# Altium schematic sheet Sheet1.SchDoc
size A4; SheetNumber: 1; SheetTotal: 2
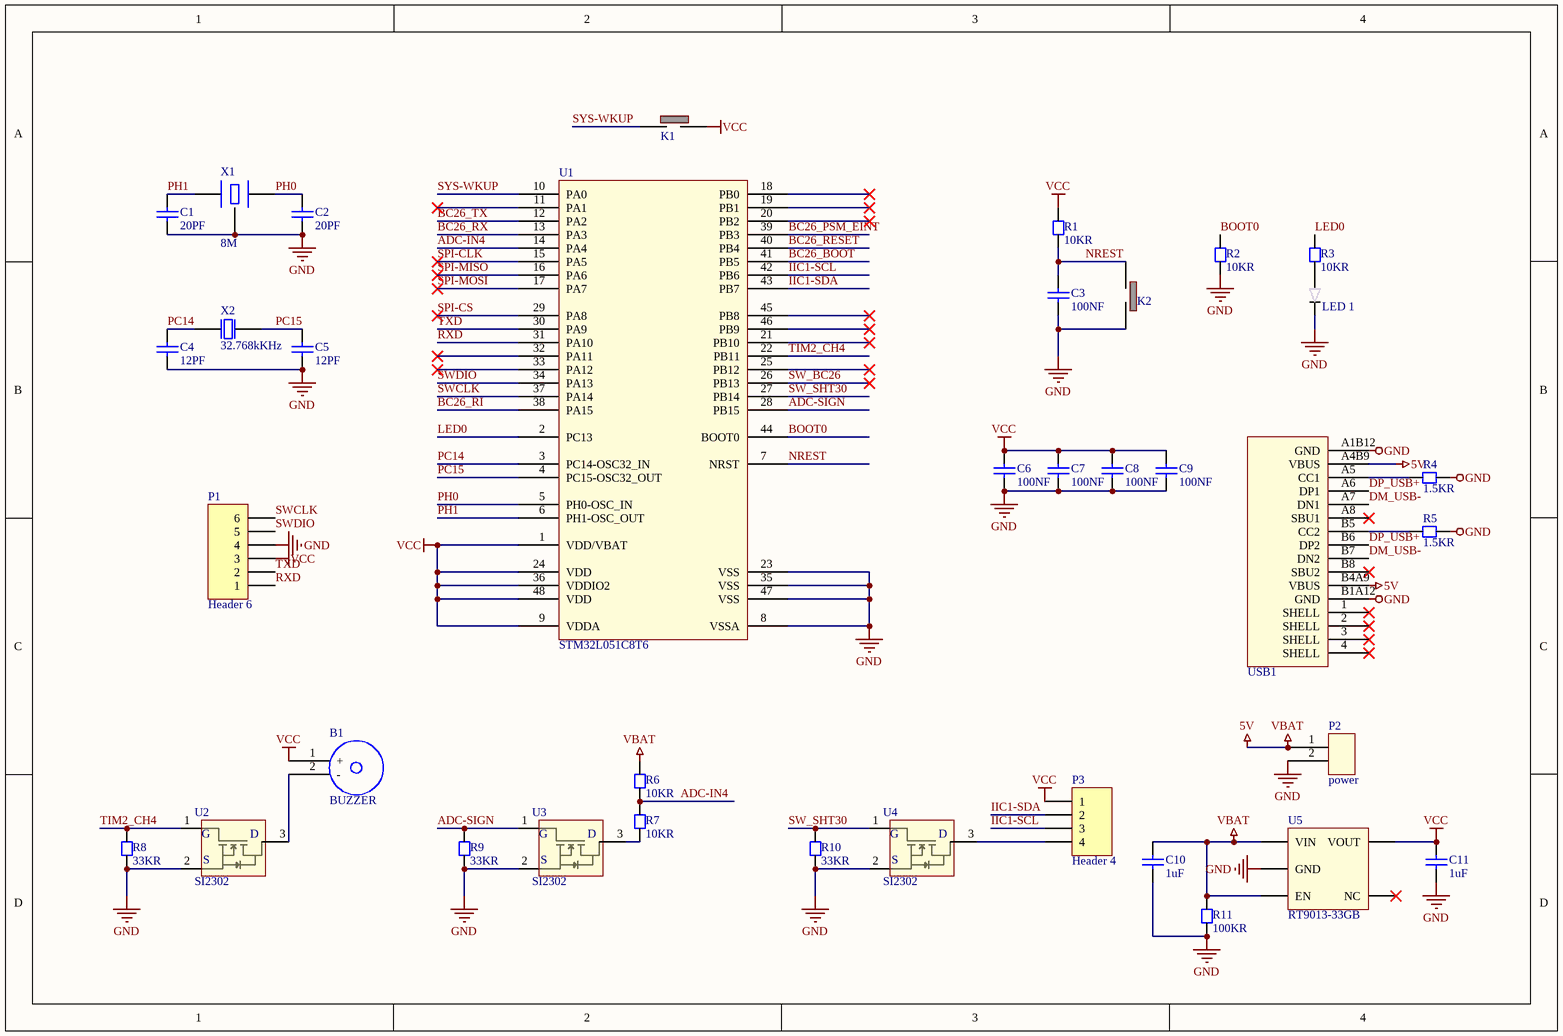
[diagram p0: Sheet1.SchDoc]

## Parts
B1  BUZZER  [Buzzer]
C1  20PF  [CC1608-0603]
C2  20PF  [CC1608-0603]
C3  100NF  [CC1608-0603]
C4  12PF  [CC1608-0603]
C5  12PF  [CC1608-0603]
C6  100NF  [CC1608-0603]
C7  100NF  [CC1608-0603]
C8  100NF  [CC1608-0603]
C9  100NF  [CC1608-0603]
C10  1uF  [CC1608-0603]
C11  1uF  [CC1608-0603]
K1  KEY 3*4  [KEY 3*4]  (value not drawn)
K2  KEY 3*4  [KEY 3*4]  (value not drawn)
LED_1  LED 0603  [LED 0603]  (value not drawn)
P1  Header 6  [HDR1X6]
P2  power  [power-5V]
P3  Header 4  [HX2.54-4]
R1  10KR  [CR1608-0603]
R2  10KR  [CR1608-0603]
R3  10KR  [CR1608-0603]
R4  1.5KR  [CR1608-0603]
R5  1.5KR  [CR1608-0603]
R6  10KR  [CR1608-0603]
R7  10KR  [CR1608-0603]
R8  33KR  [CR1608-0603]
R9  33KR  [CR1608-0603]
R10  33KR  [CR1608-0603]
R11  100KR  [CR1608-0603]
U1  STM32L051C8T6  [LQFP-48]
U2  SI2302  [SOT-23]
U3  SI2302  [SOT-23]
U4  SI2302  [SOT-23]
U5  RT9013-33GB  [SOT23-5]
USB1  Tpye-c 16P  [TYPE-C 16P]  (value not drawn)
X1  8M  [XTAL-3225]
X2  32.768kKHz  [XTAL-3215]

## Nets
5V: C10.2 P2.1 R6.2 R11.2 U5.1(VIN) U5.3(EN) USB1.A4B9(VBUS) USB1.B4A9(VBUS)  [also labelled VBAT]
GND: C1.1 C2.1 C3.1 C4.1 C5.1 C6.1 C7.1 C8.1 C9.1 C10.1 C11.1 K2.2 LED_1.2 P1.4 P2.2 R2.1 R4.1 R5.1 R8.2 R9.2 R10.2 R11.1 U1.8(VSSA) U1.23(VSS) U1.35(VSS) U1.47(VSS) U2.2(SOURCE) U3.2(SOURCE) U4.2(SOURCE) U5.2(GND) USB1.A1B12(GND) USB1.B1A12(GND) X1.2(GND)
VCC: B1.1(+) C6.2 C7.2 C8.2 C9.2 C11.2 K1.2 P1.3 P3.1 R1.2 U1.1(VDD/VBAT) U1.9(VDDA) U1.24(VDD) U1.36(VDDIO2) U1.48(VDD) U5.5(VOUT)
ADC-IN4: R6.1 R7.2 U1.14(PA4)
ADC-SIGN: R9.1 U1.28(PB15) U3.1(GATE)
BC26_BOOT: U1.41(PB5)
BC26_PSM_EINT: U1.39(PB3)
BC26_RESET: U1.40(PB4)
BC26_RI: U1.38(PA15)
BC26_RX: U1.13(PA3)
BC26_TX: U1.12(PA2)
BOOT0: R2.2 U1.44(BOOT0)
DM_USB-: USB1.A7(DN1) USB1.B7(DN2)
DP_USB+: USB1.A6(DP1) USB1.B6(DP2)
IIC1-SCL: P3.3 U1.42(PB6)
IIC1-SDA: P3.2 U1.43(PB7)
LED0: R3.2 U1.2(PC13)
NREST: C3.2 K2.1 R1.1 U1.7(NRST)
PC14: C4.2 U1.3(PC14-OSC32_IN) X2.1(OSC1)
PC15: C5.2 U1.4(PC15-OSC32_OUT) X2.2(OSC2)
PH0: C2.2 U1.5(PH0-OSC_IN) X1.3(OSC2)
PH1: C1.2 U1.6(PH1-OSC_OUT) X1.1(OSC1)
RXD: P1.1 U1.31(PA10)
SPI-CLK: U1.15(PA5)
SPI-CS: U1.29(PA8)
SPI-MISO: U1.16(PA6)
SPI-MOSI: U1.17(PA7)
SW_BC26: U1.26(PB13)
SW_SHT30: R10.1 U1.27(PB14) U4.1(GATE)
SWCLK: P1.6 U1.37(PA14)
SWDIO: P1.5 U1.34(PA13)
SYS-WKUP: K1.1 U1.10(PA0)
TIM2_CH4: R8.1 U1.22(PB11) U2.1(GATE)
TXD: P1.2 U1.30(PA9)
NetB1_2: B1.2(-) U2.3(DRAIN)
NetLED_1_1: LED_1.1 R3.1
NetP3_4: P3.4 U4.3(DRAIN)
NetR4_2: R4.2 USB1.A5(CC1)
NetR5_2: R5.2 USB1.B5(CC2)
NetR7_1: R7.1 U3.3(DRAIN)

Not connected (* = marked no-connect by the designer): U1 11(PA1)* 18(PB0)* 19(PB1)* 20(PB2)* 21(PB10)* 25(PB12)* 32(PA11)* 33(PA12)* 45(PB8)* 46(PB9)*; U5 4(NC)*; USB1 1(SHELL)* 2(SHELL)* 3(SHELL)* 4(SHELL)* A8(SBU1)* B8(SBU2)*

## Notes on the sheet
- (in symbol SI2302) G; D; S

## Library data of the parts
B1 = BUZZER: 蜂鸣器 0905 直径9毫米，高度5毫米
C1-C11 = Chip capacitor: 贴片电容
K1 K2 = KEY 3*4: 轻触开关按键
P1 = Header 6: Header, 6-Pin; LatestRevisionDate: 17-Jul-2002; LatestRevisionNote: Re-released for DXP Platform.; Publisher: Altium Limited
P3 = Header 4: Header, 4-Pin; LatestRevisionDate: 17-Jul-2002; LatestRevisionNote: Re-released for DXP Platform.; Publisher: Altium Limited
R1-R11 = Chip resistor: 贴片电阻
U1 = STM32L051C8T6: 超低功耗单片机
U2-U4 = SI2302: NMOS场效应MOS管 SOT-23
U5 = RT9013-33GB: LDO 2.2-5.2V IN 500Ma OUT SOT23-5
USB1 = Tpye-c 16P: 16P 封装的TYPE -c接口 4固定插脚 双向
X1 = XTAL 3225: 3225封装的晶振
X2 = XTAL 3215 32.768kKHz: 3215封装的时钟晶振